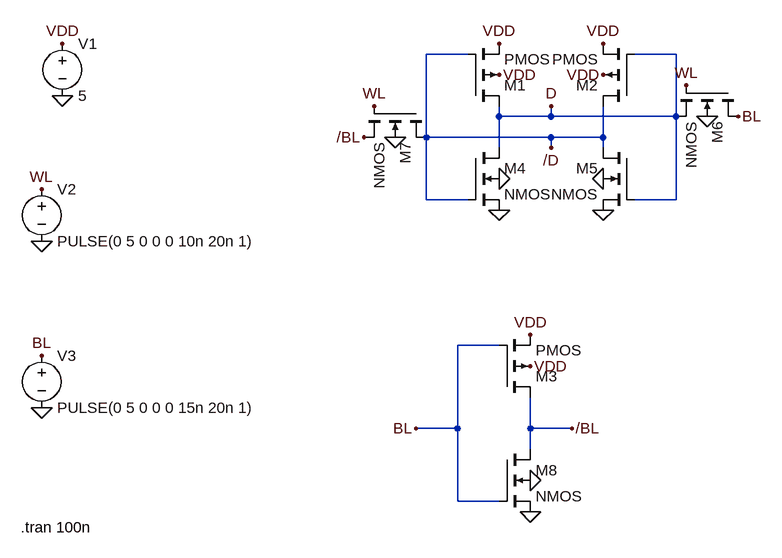
[diagram p0: schematic WRITE1.asc]
WRITE1.asc, the LTspice schematic file:
Version 4
SHEET 1 880 856
WIRE 80 112 16 112
WIRE 400 112 336 112
WIRE 128 208 128 192
WIRE 208 208 208 192
WIRE 208 208 128 208
WIRE 400 208 400 112
WIRE 400 208 208 208
WIRE 16 240 16 112
WIRE 208 240 16 240
WIRE 288 240 288 192
WIRE 288 240 208 240
WIRE 128 256 128 208
WIRE 208 256 208 240
WIRE 288 256 288 240
WIRE 16 336 16 240
WIRE 80 336 16 336
WIRE 400 336 400 208
WIRE 400 336 336 336
WIRE 128 560 64 560
WIRE 64 688 64 560
WIRE 64 688 0 688
WIRE 176 688 176 640
WIRE 240 688 176 688
WIRE 176 720 176 688
WIRE 64 800 64 688
WIRE 128 800 64 800
FLAG -544 96 VDD
FLAG -544 176 0
FLAG 128 144 VDD
FLAG 288 144 VDD
FLAG 176 592 VDD
FLAG 176 544 VDD
FLAG 128 304 0
FLAG 176 768 0
FLAG 176 816 0
FLAG -576 400 0
FLAG -576 656 0
FLAG -576 576 BL
FLAG -576 320 WL
FLAG 288 304 0
FLAG -32 240 0
FLAG -64 192 WL
FLAG 448 208 0
FLAG 416 160 WL
FLAG 240 688 /BL
FLAG -80 240 /BL
FLAG 128 96 VDD
FLAG 288 96 VDD
FLAG 128 352 0
FLAG 288 352 0
FLAG 0 688 BL
FLAG 208 192 D
FLAG 208 256 /D
FLAG 496 208 BL
SYMBOL pmos4 80 192 M180
SYMATTR InstName M1
SYMBOL pmos4 336 192 R180
SYMATTR InstName M2
SYMBOL pmos4 128 640 M180
SYMATTR InstName M3
SYMBOL nmos4 16 192 R90
SYMATTR InstName M7
SYMBOL nmos4 80 256 R0
SYMATTR InstName M4
SYMBOL nmos4 128 720 R0
SYMATTR InstName M8
SYMBOL voltage -544 80 R0
SYMATTR InstName V1
SYMATTR Value 5
SYMBOL nmos4 336 256 M0
SYMATTR InstName M5
SYMBOL voltage -576 304 R0
WINDOW 123 0 0 Left 0
WINDOW 39 0 0 Left 0
SYMATTR InstName V2
SYMATTR Value PULSE(0 5 0 0 0 10n 20n 1)
SYMBOL voltage -576 560 R0
WINDOW 123 0 0 Left 0
WINDOW 39 0 0 Left 0
SYMATTR InstName V3
SYMATTR Value PULSE(0 5 0 0 0 15n 20n 1)
SYMBOL nmos4 496 160 R90
SYMATTR InstName M6
TEXT -608 840 Left 2 !.tran 100n

The netlist it stands for:
* WRITE1.asc
M1 D /D VDD VDD PMOS
M2 /D D VDD VDD PMOS
M3 /BL BL VDD VDD PMOS
M7 /D WL /BL 0 NMOS
M4 D /D 0 0 NMOS
M8 /BL BL 0 0 NMOS
V1 VDD 0 5
M5 /D D 0 0 NMOS
V2 WL 0 PULSE(0 5 0 0 0 10n 20n 1)
V3 BL 0 PULSE(0 5 0 0 0 15n 20n 1)
M6 BL WL D 0 NMOS
.model NMOS NMOS
.model PMOS PMOS
.lib standard.mos
.tran 100n
.backanno
.end